# Altium project Wally_DriveMotorEncoderBoard.PrjPcb
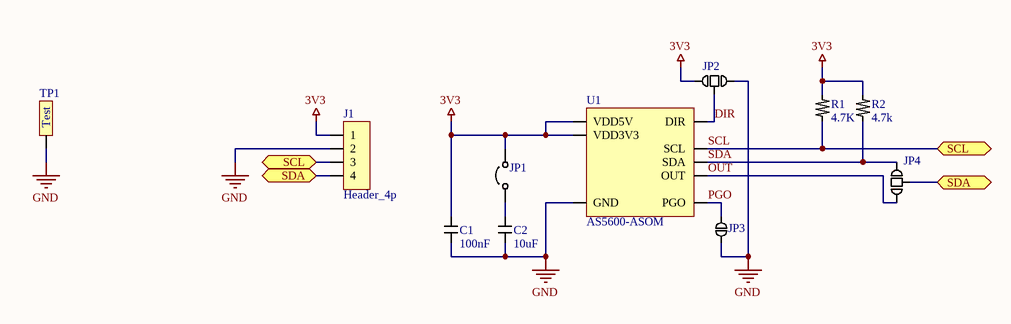
[diagram p0: DriveMotorEncoderBoard.SchDoc]
1 sheet, 11 parts. Net scope: flat (ports and power ports of the same name join across sheets).
Board file: DriveMotorEncoderBoard.PcbDoc

## Sheet DriveMotorEncoderBoard.SchDoc
size A4; SheetNumber: 1; SheetTotal: 1

### Parts
C1  100nF  [0805]
C2  10uF  [0805]
J1  Header_4p  [BareWire_4p]
JP1  JumperHeader_0.100"_2p  [JumperHeader_0.100"_2p]  (value not drawn)
JP2  SolderJumper_3p  [SolderJumper_3p]  (value not drawn)
JP3  SolderJumper_2p  [SolderJumper_2p]  (value not drawn)
JP4  SolderJumper_3p  [SolderJumper_3p]  (value not drawn)
R1  4.7K  [0805]
R2  4.7k  [0805]
TP1  TestPoint  [TestPoint]  (value not drawn)
U1  AS5600-ASOM  [SOIC-8]

### Ports
SCL (bidir), SDA (bidir)

### Nets
3V3: C1.2 J1.1 JP1.2 JP2.1 R1.2 R2.2 U1.1(VDD5V) U1.2(VDD3V3)
GND: C1.1 C2.1 J1.2 JP2.3 JP3.1 TP1.1 U1.4(GND)
DIR: JP2.2 U1.8(DIR)
OUT: JP4.1 U1.3(OUT)
PGO: JP3.2 U1.5(PGO)
SCL: J1.3 R1.1 U1.7(SCL) ; port SCL
SDA: JP4.3 R2.1 U1.6(SDA)
NetC2_2: C2.2 JP1.1
NetJ1_4: J1.4 JP4.2 ; port SDA

### Notes on the sheet
- (in symbol TestPoint) Test

### Library data of the parts
C1 C2 = Capacitor
R1 R2 = Resistor
U1 = AS5600-ASOM: 12-bit contactless encoder using diametrically polarized magnet